# EAGLE schematic Ardiono DTMF (EAGLE 6.4)
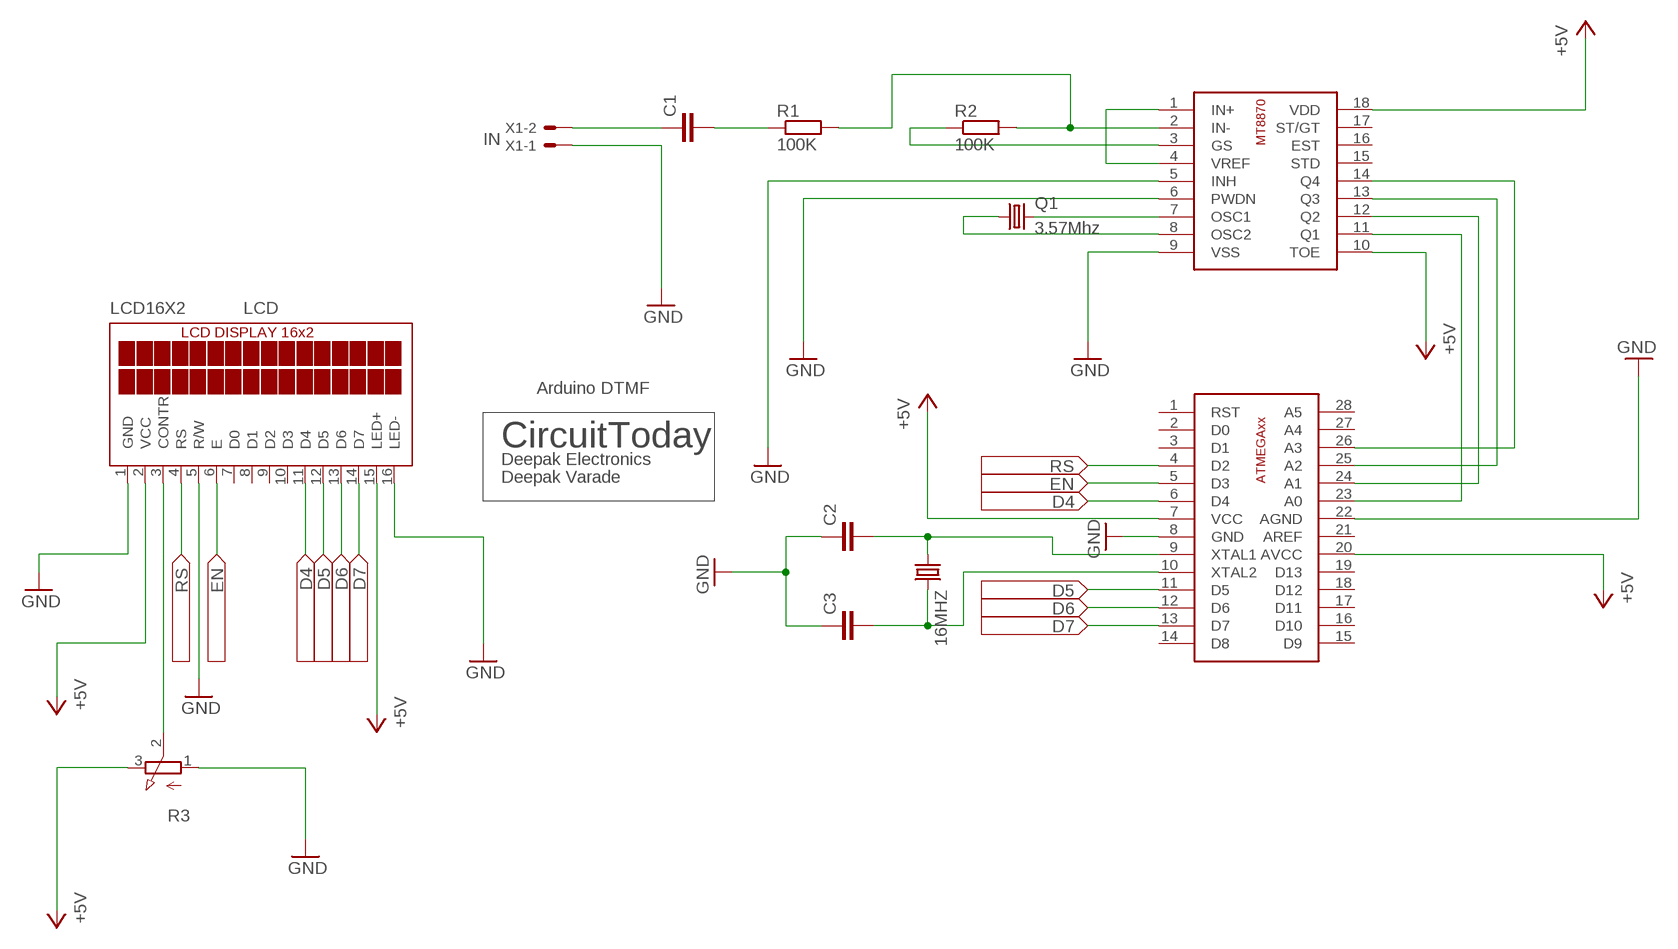
[diagram p0: schematic, sheet 1]

## Parts
16MHZ  CRYSTALHC49U70  [HC49U70]
C1  C-EU025-025X050  [C025-025X050]
C2  C-EU025-025X050  [C025-025X050]
C3  C-EU025-025X050  [C025-025X050]
LCD16X2  LCD  TUXGR_16X2_R2  [TUXGR_16X2_R2]
Q1  3.57Mhz  CRYSTALHC49U70  [HC49U70]
R1  100K  R-EU_0204/2V  [0204V]
R2  100K  R-EU_0204/2V  [0204V]
R3  3RP/1610N  [3RP/1610N]
U$1  ARDUINOXX  [ARDUINOXX]
U$2  MT8870  [MT8870]
X1  22-23-2021  [22-23-2021]

## Nets
+5V: LCD16X2.2(VCC) LCD16X2.15(LED+) R3.3(E) U$1.7(VCC) U$1.20(AVCC) U$2.10(TOE) U$2.18(VDD)
D4: LCD16X2.11(D4) U$1.6(D4)
D5: LCD16X2.12(D5) U$1.11(D5)
D6: LCD16X2.13(D6) U$1.12(D6)
D7: LCD16X2.14(D7) U$1.13(D7)
E: LCD16X2.6(E) U$1.5(D3)
GND: C2.1 C3.1 LCD16X2.1(GND) LCD16X2.5(R/W) LCD16X2.16(LED-) R3.1(A) U$1.8(GND) U$1.22(AGND) U$2.5(INH) U$2.6(PWDN) U$2.9(VSS) X1.1
N$1: 16MHZ.1 C2.2 U$1.9(XTAL1)
N$3: Q1.2 U$2.7(OSC1)
N$4: Q1.1 U$2.8(OSC2)
N$5: U$1.23(A0) U$2.11(Q1)
N$6: U$1.24(A1) U$2.12(Q2)
N$7: U$1.25(A2) U$2.13(Q3)
N$8: U$1.26(A3) U$2.14(Q4)
N$9: R1.2 R2.2 U$2.2(IN-)
N$10: R2.1 U$2.3(GS)
N$11: 16MHZ.2 C3.2 U$1.10(XTAL2)
N$12: U$2.1(IN+) U$2.4(VREF)
N$14: C1.2 R1.1
N$15: LCD16X2.3(CONTR) R3.2(S)
N$18: C1.1 X1.2
RS: LCD16X2.4(RS) U$1.4(D2)
Unconnected: LCD16X2.7(D0) LCD16X2.8(D1) LCD16X2.9(D2) LCD16X2.10(D3) U$1.1(RST) U$1.2(D0) U$1.3(D1) U$1.14(D8) U$1.15(D9) U$1.16(D10) U$1.17(D11) U$1.18(D12) U$1.19(D13) U$1.21(AREF) U$1.27(A4) U$1.28(A5) U$2.15(STD) U$2.16(EST) U$2.17(ST/GT)

## Notes on the sheet
- IN
- Arduino DTMF
- CircuitToday
- Deepak Electronics
- Deepak Varade

## Library data of the parts
16MHZ Q1 = crystal:CRYSTAL: CRYSTAL; OC_FARNELL: unknown; OC_NEWARK: unknown
C1-C3 = resistor:C-EU: CAPACITOR, European symbol
LCD16X2 = display-lcd:TUXGR_16X2_R2: Tuxgraphics LCD display 16x2 characters reflective, without background light Source: tuxgr_12x2_r2.pdf; OC_FARNELL: unknown; OC_NEWARK: unknown
R1 R2 = resistor:R-EU_: RESISTOR, European symbol
R3 = pot:3RP/1610N: 16mm Potentiometer one level Source: http://www.alphapotentiometers.net/html/16mm_pot_2.html
U$1 = DTMF Arduino:ARDUINOXX
U$2 = DTMF Arduino:MT8870
X1 = con-molex:22-23-2021: .100" (2.54mm) Center Header - 2 Pin; MF: MOLEX; MPN: 22-23-2021; OC_FARNELL: 1462926; OC_NEWARK: 25C3832